# EAGLE design V3_nano (EAGLE 8.5.1)

## Sheet 1 of 8: ATMEGA328p
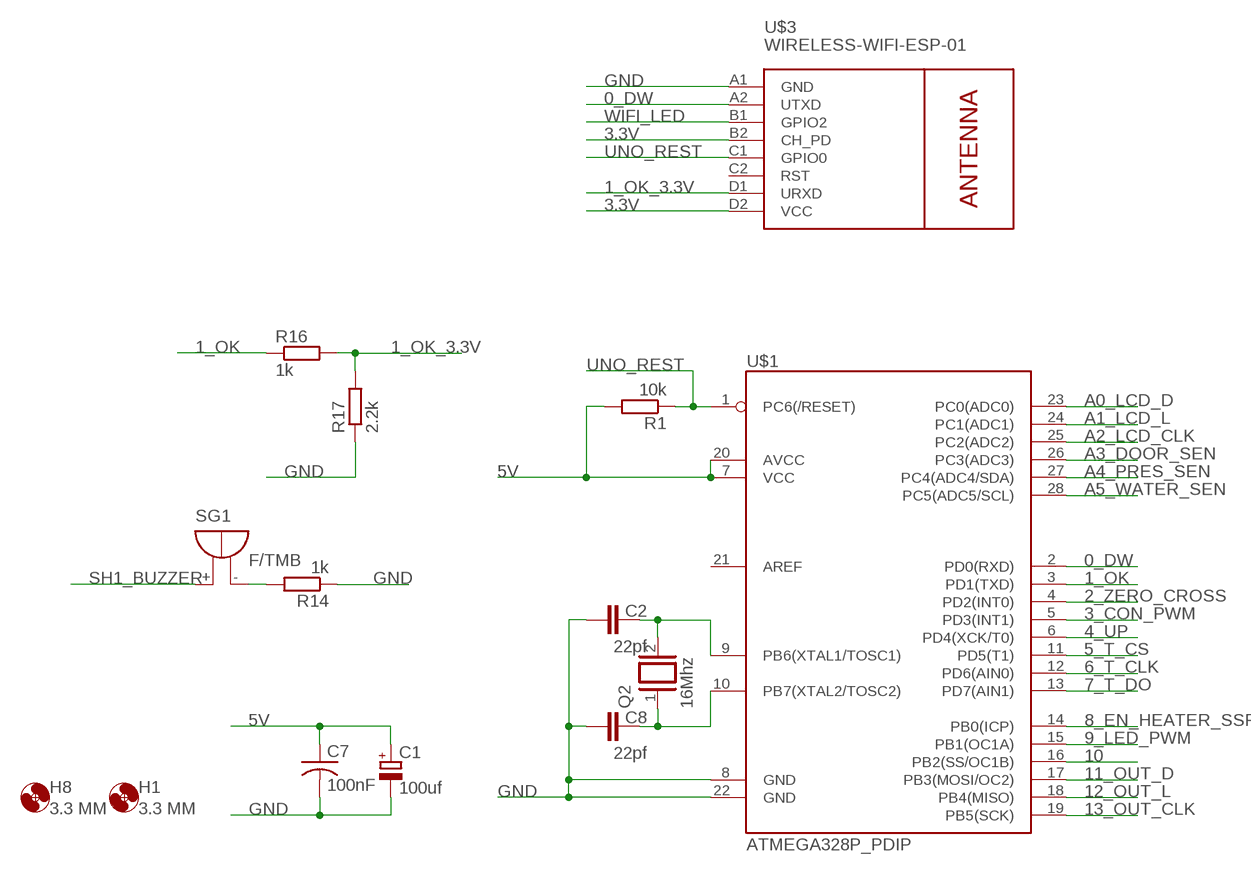
[diagram p0: schematic, sheet 1]

### Parts
C1  100uf  CPOL-EUE3.5-8  [E3,5-8]
C2  22pf  C-EU050-030X075  [C050-030X075]
C7  100nF  C-US050-035X075  [C050-035X075]
C8  22pf  C-EU050-030X075  [C050-030X075]
H1  3.3 MM  MOUNT-HOLE3.3  [3,3]
H8  3.3 MM  MOUNT-HOLE3.3  [3,3]
Q2  16Mhz  XTAL/S  [QS]
R1  10k  R-EU_0207/10  [0207/10]
R14  1k  R-EU_0207/10  [0207/10]
R16  1k  R-EU_0207/10  [0207/10]
R17  2.2k  R-EU_0207/10  [0207/10]
SG1  F/TMB  [F/TMB]
U$1  ATMEGA328P_PDIP  [DIL-28-3]
U$3  WIRELESS-WIFI-ESP-01  [WIRELESS-WIFI-ESP-01]

### Nets
0_DW: U$1.2(PD0(RXD)) U$3.A2(UTXD) ; also sheet 5
1_OK: R16.1 U$1.3(PD1(TXD)) ; also sheet 5
1_OK_3.3V: R16.2 R17.2 U$3.D1(URXD)
2_ZERO_CROSS: U$1.4(PD2(INT0)) ; also sheet 4
3.3V: U$3.B2(CH_PD) U$3.D2(VCC) ; also sheet 6
3_CON_PWM: U$1.5(PD3(INT1)) ; also sheet 3
4_UP: U$1.6(PD4(XCK/T0)) ; also sheet 5
5_T_CS: U$1.11(PD5(T1))
5V: C1.+ C7.1 R1.2 U$1.7(VCC) U$1.20(AVCC) ; also sheet 3,4,5,6,7,8
6_T_CLK: U$1.12(PD6(AIN0))
7_T_DO: U$1.13(PD7(AIN1))
8_EN_HEATER_SSR: U$1.14(PB0(ICP)) ; also sheet 5
9_LED_PWM: U$1.15(PB1(OC1A)) ; also sheet 3
10: U$1.16(PB2(SS/OC1B))
11_OUT_D: U$1.17(PB3(MOSI/OC2)) ; also sheet 8
12_OUT_L: U$1.18(PB4(MISO)) ; also sheet 8
13_OUT_CLK: U$1.19(PB5(SCK)) ; also sheet 8
A0_LCD_D: U$1.23(PC0(ADC0)) ; also sheet 3
A1_LCD_L: U$1.24(PC1(ADC1)) ; also sheet 3
A2_LCD_CLK: U$1.25(PC2(ADC2)) ; also sheet 3
A3_DOOR_SEN: U$1.26(PC3(ADC3)) ; also sheet 5
A4_PRES_SEN: U$1.27(PC4(ADC4/SDA)) ; also sheet 5
A5_WATER_SEN: U$1.28(PC5(ADC5/SCL)) ; also sheet 5
GND: C1.- C2.1 C7.2 C8.1 R14.1 R17.1 U$1.8(GND) U$1.22(GND) U$3.A1(GND) ; also sheet 3,4,5,6,7,8
N$1: C2.2 Q2.2 U$1.9(PB6(XTAL1/TOSC1))
N$4: C8.2 Q2.1 U$1.10(PB7(XTAL2/TOSC2))
N$62: R14.2 SG1.-
SH1_BUZZER: SG1.+ ; also sheet 8
UNO_REST: R1.1 U$1.1(PC6(/RESET)) U$3.C1(GPIO0)
WIFI_LED: U$3.B1(GPIO2)
Unconnected: U$1.21(AREF) U$3.C2(RST)

## Sheet 2 of 8: Relays
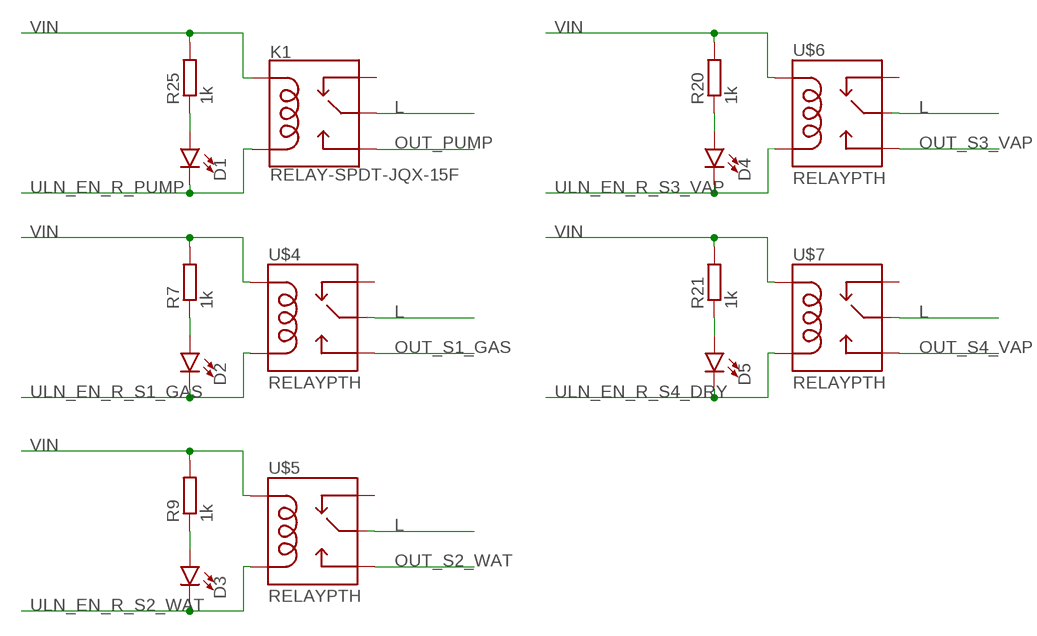
[diagram p1: schematic, sheet 2]

### Parts
D1  LED5MM  [LED_5MM]
D2  LED5MM  [LED_5MM]
D3  LED5MM  [LED_5MM]
D4  LED5MM  [LED_5MM]
D5  LED5MM  [LED_5MM]
K1  RELAY-SPDT-JQX-15F  [RELAY-T90]
R7  1k  R-EU_0207/10  [0207/10]
R9  1k  R-EU_0207/10  [0207/10]
R20  1k  R-EU_0207/10  [0207/10]
R21  1k  R-EU_0207/10  [0207/10]
R25  1k  R-EU_0207/10  [0207/10]
U$4  RELAYPTH  [SRD-05VDC-SL-C]
U$5  RELAYPTH  [SRD-05VDC-SL-C]
U$6  RELAYPTH  [SRD-05VDC-SL-C]
U$7  RELAYPTH  [SRD-05VDC-SL-C]

### Nets
L: K1.MAIN U$4.SWCOMMON U$5.SWCOMMON U$6.SWCOMMON U$7.SWCOMMON ; also sheet 5
N$8: D2.A R7.1
N$10: D3.A R9.1
N$11: D4.A R20.1
N$13: D5.A R21.1
N$16: D1.A R25.1
OUT_PUMP: K1.NO ; also sheet 5
OUT_S1_GAS: U$4.SWOPEN ; also sheet 5
OUT_S2_WAT: U$5.SWOPEN ; also sheet 5
OUT_S3_VAP: U$6.SWOPEN ; also sheet 5
OUT_S4_VAP: U$7.SWOPEN
ULN_EN_R_PUMP: D1.K(C) K1.COIL2 ; also sheet 8
ULN_EN_R_S1_GAS: D2.K(C) U$4.COIL0 ; also sheet 8
ULN_EN_R_S2_WAT: D3.K(C) U$5.COIL0 ; also sheet 8
ULN_EN_R_S3_VAP: D4.K(C) U$6.COIL0 ; also sheet 8
ULN_EN_R_S4_DRY: D5.K(C) U$7.COIL0 ; also sheet 8
VIN: K1.COIL1 R7.2 R9.2 R20.2 R21.2 R25.2 U$4.COIL1 U$5.COIL1 U$6.COIL1 U$7.COIL1 ; also sheet 6,8
Unconnected: K1.NC U$4.SWCLOSED(SWCLOSE) U$5.SWCLOSED(SWCLOSE) U$6.SWCLOSED(SWCLOSE) U$7.SWCLOSED(SWCLOSE)

## Sheet 3 of 8: LCD_Shift
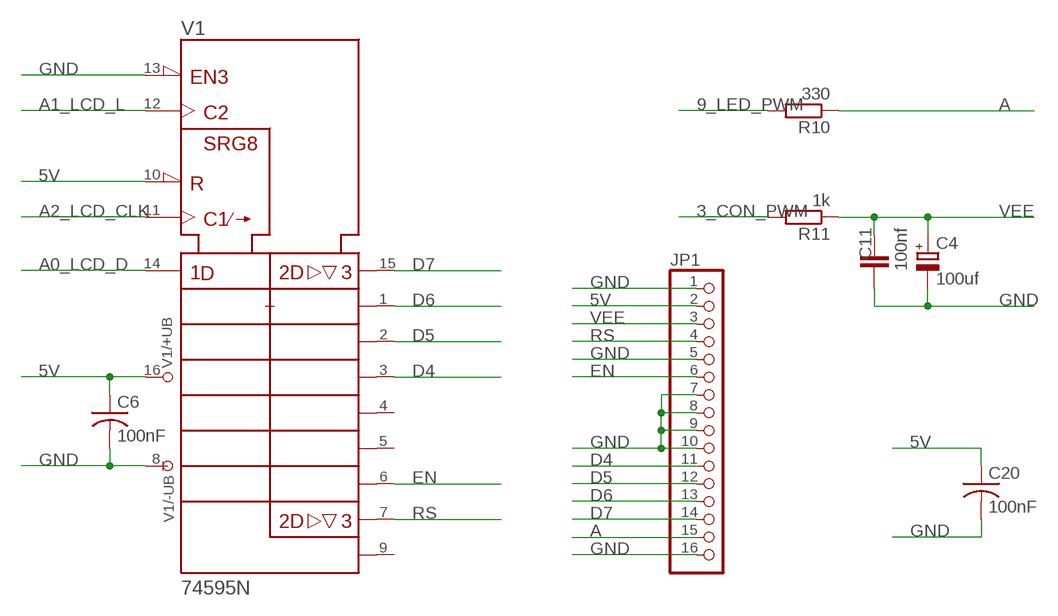
[diagram p2: schematic, sheet 3]

### Parts
C4  100uf  CPOL-EUE3.5-8  [E3,5-8]
C6  100nF  C-US050-035X075  [C050-035X075]
C11  100nf  C-EU050-030X075  [C050-030X075]
C20  100nF  C-US050-035X075  [C050-035X075]
JP1  PINHD-1X16  [1X16]
R10  330  R-EU_0207/10  [0207/10]
R11  1k  R-EU_0207/10  [0207/10]
V1  74595N  [DIL16]

### Nets
3_CON_PWM: R11.2 ; also sheet 1
5V: C6.1 C20.1 JP1.2 V1.10(!SRCLR) V1.16(+UB) ; also sheet 1,4,5,6,7,8
9_LED_PWM: R10.2 ; also sheet 1
A: JP1.15 R10.1
A0_LCD_D: V1.14(SER) ; also sheet 1
A1_LCD_L: V1.12(RCK) ; also sheet 1
A2_LCD_CLK: V1.11(SRCK) ; also sheet 1
D4: JP1.11 V1.3(QD)
D5: JP1.12 V1.2(QC)
D6: JP1.13 V1.1(QB)
D7: JP1.14 V1.15(QA)
EN: JP1.6 V1.6(QG)
GND: C4.- C6.2 C11.1 C20.2 JP1.1 JP1.5 JP1.7 JP1.8 JP1.9 JP1.10 JP1.16 V1.8(-UB) V1.13(!G) ; also sheet 1,4,5,6,7,8
RS: JP1.4 V1.7(QH)
VEE: C4.+ C11.2 JP1.3 R11.1
Unconnected: V1.4(QE) V1.5(QF) V1.9(QH*)

## Sheet 4 of 8: Zero_Cross Detect
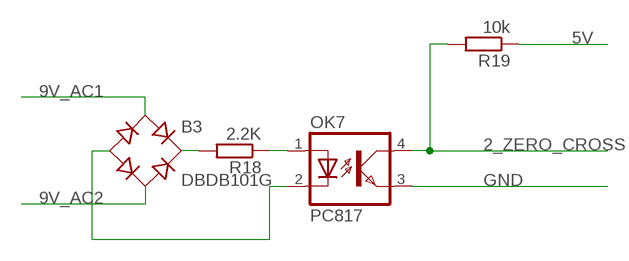
[diagram p3: schematic, sheet 4]

### Parts
B3  DBDB101G  [DB]
OK7  PC817  [DIL04]
R18  2.2K  R-EU_0207/10  [0207/10]
R19  10k  R-EU_0207/10  [0207/10]

### Nets
2_ZERO_CROSS: OK7.4(COL) R19.2 ; also sheet 1
5V: R19.1 ; also sheet 1,3,5,6,7,8
9V_AC1: B3.AC1 ; also sheet 5,6
9V_AC2: B3.AC2 ; also sheet 5,6
GND: OK7.3(EMIT) ; also sheet 1,3,5,6,7,8
N$47: B3.+ R18.2
N$48: OK7.1(A) R18.1
N$49: B3.- OK7.2(C)

## Sheet 5 of 8: Terminals
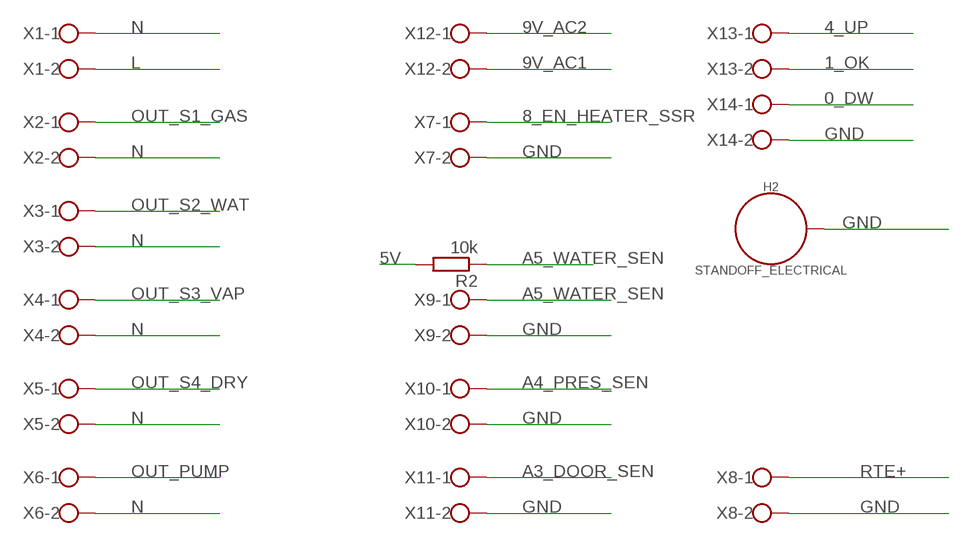
[diagram p4: schematic, sheet 5]

### Parts
H2  STANDOFF_ELECTRICAL  [STANDOFF-ELECTRICAL]
R2  10k  R-EU_0207/10  [0207/10]
X1  W237-102  [W237-102]
X2  W237-102  [W237-102]
X3  W237-102  [W237-102]
X4  W237-102  [W237-102]
X5  W237-102  [W237-102]
X6  W237-102  [W237-102]
X7  W237-102  [W237-102]
X8  W237-102  [W237-102]
X9  W237-102  [W237-102]
X10  W237-102  [W237-102]
X11  W237-102  [W237-102]
X12  W237-102  [W237-102]
X13  W237-102  [W237-102]
X14  W237-102  [W237-102]

### Nets
0_DW: X14.1 ; also sheet 1
1_OK: X13.2 ; also sheet 1
4_UP: X13.1 ; also sheet 1
5V: R2.2 ; also sheet 1,3,4,6,7,8
8_EN_HEATER_SSR: X7.1 ; also sheet 1
9V_AC1: X12.2 ; also sheet 4,6
9V_AC2: X12.1 ; also sheet 4,6
A3_DOOR_SEN: X11.1 ; also sheet 1
A4_PRES_SEN: X10.1 ; also sheet 1
A5_WATER_SEN: R2.1 X9.1 ; also sheet 1
GND: H2.P1 X7.2 X8.2 X9.2 X10.2 X11.2 X14.2 ; also sheet 1,3,4,6,7,8
L: X1.2 ; also sheet 2
N: X1.1 X2.2 X3.2 X4.2 X5.2 X6.2
OUT_PUMP: X6.1 ; also sheet 2
OUT_S1_GAS: X2.1 ; also sheet 2
OUT_S2_WAT: X3.1 ; also sheet 2
OUT_S3_VAP: X4.1 ; also sheet 2
OUT_S4_DRY: X5.1
RTE+: X8.1 ; also sheet 7

## Sheet 6 of 8: POWER
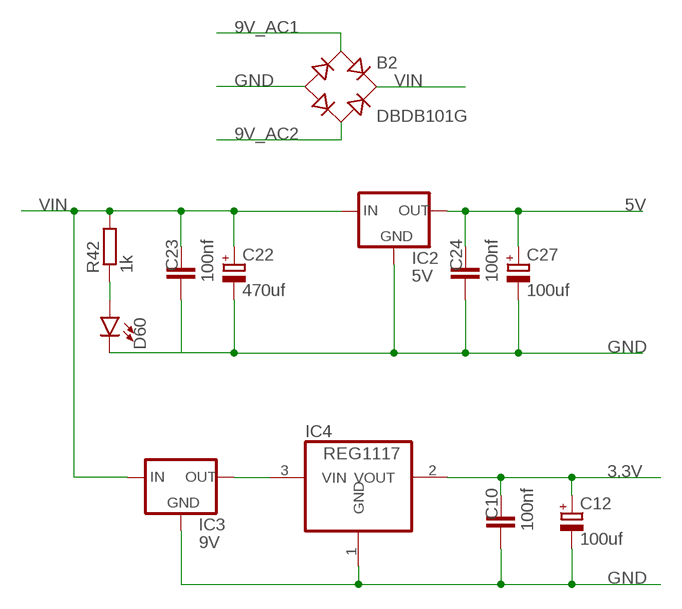
[diagram p5: schematic, sheet 6]

### Parts
B2  DBDB101G  [DB]
C10  100nf  C-EU050-030X075  [C050-030X075]
C12  100uf  CPOL-EUE3.5-8  [E3,5-8]
C22  470uf  CPOL-EUE3.5-8  [E3,5-8]
C23  100nf  C-EU050-030X075  [C050-030X075]
C24  100nf  C-EU050-030X075  [C050-030X075]
C27  100uf  CPOL-EUE3.5-8  [E3,5-8]
D60  LED5MM  [LED_5MM]
IC2  5V  V_REG_78XXSIDE  [78XXL]
IC3  9V  V_REG_78XXSIDE  [78XXL]
IC4  REG1117  [SOT223]
R42  1k  R-EU_0207/10  [0207/10]

### Nets
3.3V: C10.2 C12.+ IC4.2(VOUT) ; also sheet 1
5V: C24.2 C27.+ IC2.OUT ; also sheet 1,3,4,5,7,8
9V_AC1: B2.AC1 ; also sheet 4,5
9V_AC2: B2.AC2 ; also sheet 4,5
GND: B2.- C10.1 C12.- C22.- C23.1 C24.1 C27.- D60.K(C) IC2.GND IC3.GND IC4.1(GND) ; also sheet 1,3,4,5,7,8
N$12: IC3.OUT IC4.3(VIN)
N$74: D60.A R42.1
VIN: B2.+ C22.+ C23.2 IC2.IN IC3.IN R42.2 ; also sheet 2,8

## Sheet 7 of 8: Thermocoupler
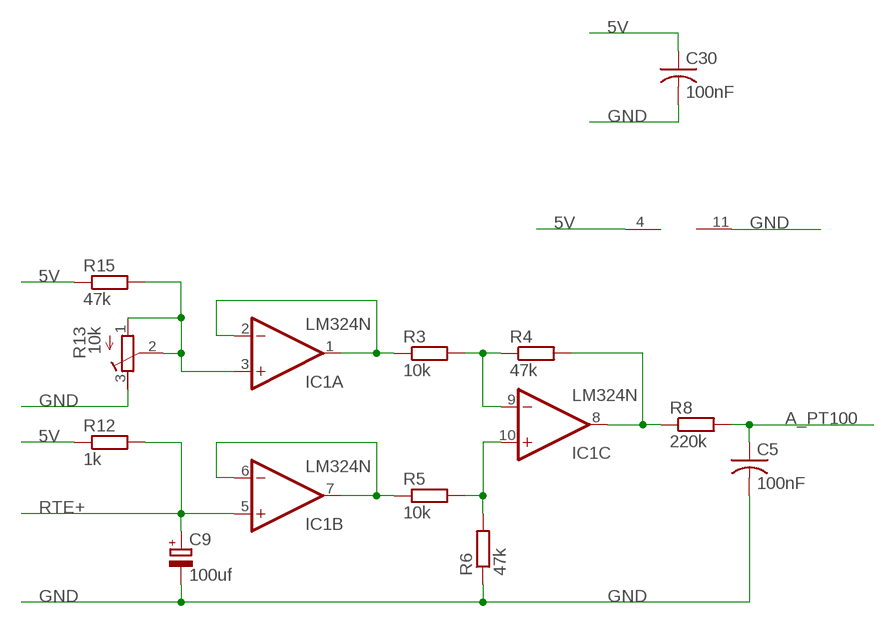
[diagram p6: schematic, sheet 7]

### Parts
C5  100nF  C-US050-035X075  [C050-035X075]
C9  100uf  CPOL-EUE3.5-8  [E3,5-8]
C30  100nF  C-US050-035X075  [C050-035X075]
IC1  LM324N  [DIL14]
R3  10k  R-EU_0207/10  [0207/10]
R4  47k  R-EU_0207/10  [0207/10]
R5  10k  R-EU_0207/10  [0207/10]
R6  47k  R-EU_0207/10  [0207/10]
R8  220k  R-EU_0207/10  [0207/10]
R12  1k  R-EU_0207/10  [0207/10]
R13  10k  R-TRIMM64W  [RTRIM64W]
R15  47k  R-EU_0207/10  [0207/10]

### Nets
5V: C30.1 IC1.4(P:V+) R12.1 R15.1 ; also sheet 1,3,4,5,6,8
A_PT100: C5.1 R8.2
GND: C5.2 C9.- C30.2 IC1.11(P:V-) R6.1 R13.3(E) ; also sheet 1,3,4,5,6,8
N$2: IC1.1(A:OUT) IC1.2(A:-IN) R3.1
N$3: IC1.9(C:-IN) R3.2 R4.1
N$5: IC1.10(C:+IN) R5.2 R6.2
N$6: IC1.6(B:-IN) IC1.7(B:OUT) R5.1
N$7: IC1.8(C:OUT) R4.2 R8.1
N$22: IC1.3(A:+IN) R13.1(A) R13.2(S) R15.2
RTE+: C9.+ IC1.5(B:+IN) R12.2 ; also sheet 5
Unconnected: IC1.12(D:+IN) IC1.13(D:-IN) IC1.14(D:OUT)

## Sheet 8 of 8: Shift Outputs
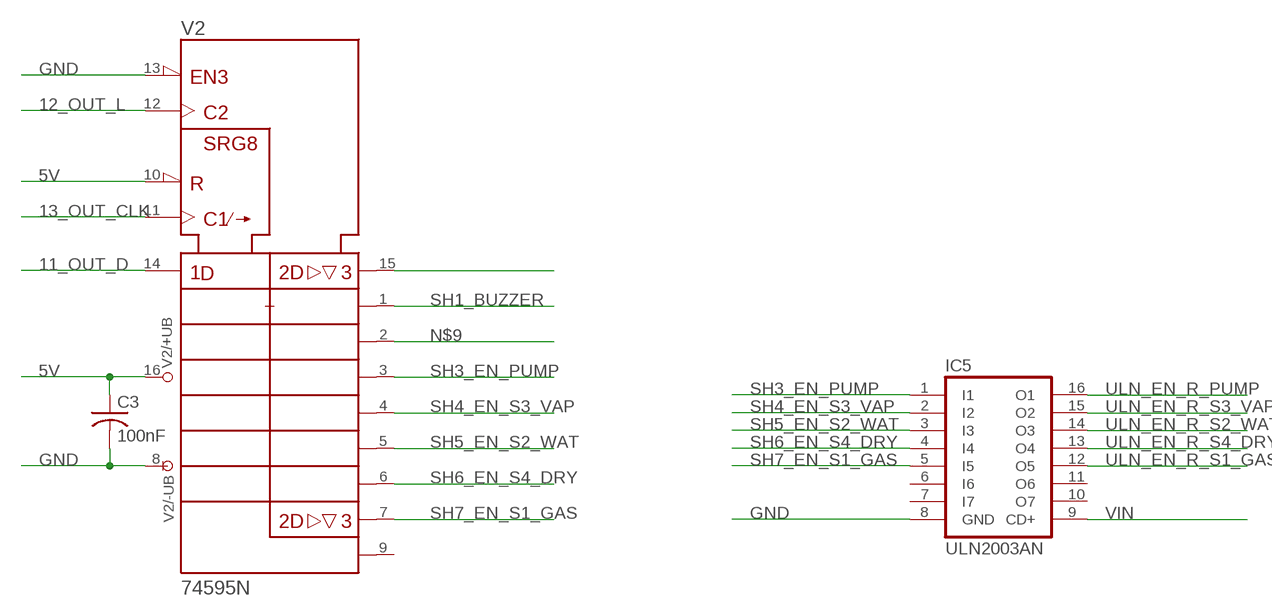
[diagram p7: schematic, sheet 8]

### Parts
C3  100nF  C-US050-035X075  [C050-035X075]
IC5  ULN2003AN  [DIL16]
V2  74595N  [DIL16]

### Nets
5V: C3.1 V2.10(!SRCLR) V2.16(+UB) ; also sheet 1,3,4,5,6,7
11_OUT_D: V2.14(SER) ; also sheet 1
12_OUT_L: V2.12(RCK) ; also sheet 1
13_OUT_CLK: V2.11(SRCK) ; also sheet 1
GND: C3.2 IC5.8(GND) V2.8(-UB) V2.13(!G) ; also sheet 1,3,4,5,6,7
N$9: V2.2(QC)
N$14: V2.15(QA)
SH1_BUZZER: V2.1(QB) ; also sheet 1
SH3_EN_PUMP: IC5.1(I1) V2.3(QD)
SH4_EN_S3_VAP: IC5.2(I2) V2.4(QE)
SH5_EN_S2_WAT: IC5.3(I3) V2.5(QF)
SH6_EN_S4_DRY: IC5.4(I4) V2.6(QG)
SH7_EN_S1_GAS: IC5.5(I5) V2.7(QH)
ULN_EN_R_PUMP: IC5.16(O1) ; also sheet 2
ULN_EN_R_S1_GAS: IC5.12(O5) ; also sheet 2
ULN_EN_R_S2_WAT: IC5.14(O3) ; also sheet 2
ULN_EN_R_S3_VAP: IC5.15(O2) ; also sheet 2
ULN_EN_R_S4_DRY: IC5.13(O4) ; also sheet 2
VIN: IC5.9(CD+) ; also sheet 2,6
Unconnected: IC5.6(I6) IC5.7(I7) IC5.10(O7) IC5.11(O6) V2.9(QH*)

## Library data of the parts
B2 B3 = rectifier:DB?*G: Single Phase 1.0 AMP Glass Passivated Bridge Rectifier Taiwan Semiconductor Co.,Ltd. - TSC Source: http://www.taiwansemi.com/TSCbig5/ezcatfiles/cust/img/img/db101g.pdf http://www.ts.com.tw/db/pictures/modules/PDT/PDT060207001/DBLS201G.pdf
C1 C4 C9 C12 C22 C27 = rcl:CPOL-EU: POLARIZED CAPACITOR, European symbol
C2 C8 C10 C11 C23 C24 = rcl:C-EU: CAPACITOR, European symbol
C3 C5-C7 C20 C30 = rcl:C-US: CAPACITOR, American symbol; SPICEPREFIX: C
D1-D5 D60 = SparkFun-LED:LED: LED (Generic) Standard schematic elements and footprints for 5mm, 3mm, 1206, and 0603 sized LEDs. Generic LEDs with no color specified.
H1 H8 = holes:MOUNT-HOLE: MOUNTING HOLE with drill center marker
H2 = SparkFun-Hardware:STANDOFF_ELECTRICAL: Stand Off Drill holes with an electrical connection. For example, use these to ground your board to a chassis. Example SparkFun Products Screw - Phillips Head (1/4", 4-40, 10 pack) <https://www.sparkfun.com/products/10453> (PRT-10453) Screw - Phillips Head (1/2", 4-40, 10 pack) <https://www.sparkfun.com/products/10452> (PRT-10452) Screw - Phillips Head (3/4", 4-40, 10 pack) <https://www.sparkfun.com/products/10451> (PRT-10451) Screw - Phillips Head (1", 4-40, 10 pack) <https://www.sparkfun.com/products/10450> (PRT-10450)
IC1 = linear:LM324: OP AMP
IC2 IC3 = SparkFun:V_REG_78XX: Voltage Regulator Standard 7805 5V regulator. IGO (Input Ground Output). Spark Fun Electronics SKU : COM-00107
IC4 = burr-brown:REG1117: 800mA and 1A Low Dropout (LDO) Positive Regulator 1.8V, 2.5V, 2.85V, 3.3V, 5V, and Adj
IC5 = uln-udn:ULN2003A: DRIVER ARRAY
JP1 = pinhead:PINHD-1X16: PIN HEADER
K1 = SparkFun-Electromechanical:RELAY-SPDT: SPDT Electromechanical Relay Single-pole, double-throw sealed relays. When current is applied to the coil, it throws a simple changeover switch, terminating the connection from the NC contact to ground and closing the NO contact. Use them to switch high voltage/high current devices. SparkFun Products JQX-15F: Relay SPDT Sealed - 20A <https://www.sparkfun.com/products/10924> (COM-10924) JZC-11F: Relay SPDT Sealed <https://www.sparkfun.com/products/100> (COM-00100); PROD_ID: COMP-10736; SF_SKU: COM-10924
OK7 = optocoupler-2:PC817: SHARP OPTO COUPLER
Q2 = special:XTAL/S: CRYSTAL
R1-R12 R14-R21 R25 R42 = rcl:R-EU_: RESISTOR, European symbol
R13 = rcl:R-TRIMM: Trimm resistor; SPICEMODEL: X; SPICEPREFIXL: POT
SG1 = buzzer:F/TMB: BUZZER Source: Buerklin; OC_FARNELL: unknown; OC_NEWARK: unknown
U$1 = FaBo-MPU:ATMEGA328P_PDIP
U$3 = diy-modules:WIRELESS-WIFI-ESP-01: Wireless Wi-Fi ESP-01 Module based on ESP8266 chip Click here to find device on ebay.com <http://www.ebay.com/sch/esp8266+esp+01+transceiver>
U$4-U$7 = SRD-05VDC-SL-C:RELAY: SPDT relay (COM-00101)
V1 V2 = 74ttl-din:74*595: 8-bit SHIFT REGISTER, output latch
X1-X14 = con-wago-500:W237-102: WAGO SCREW CLAMP; MPN: 237-102; OC_FARNELL: unknown; OC_NEWARK: 70K9898

## Board
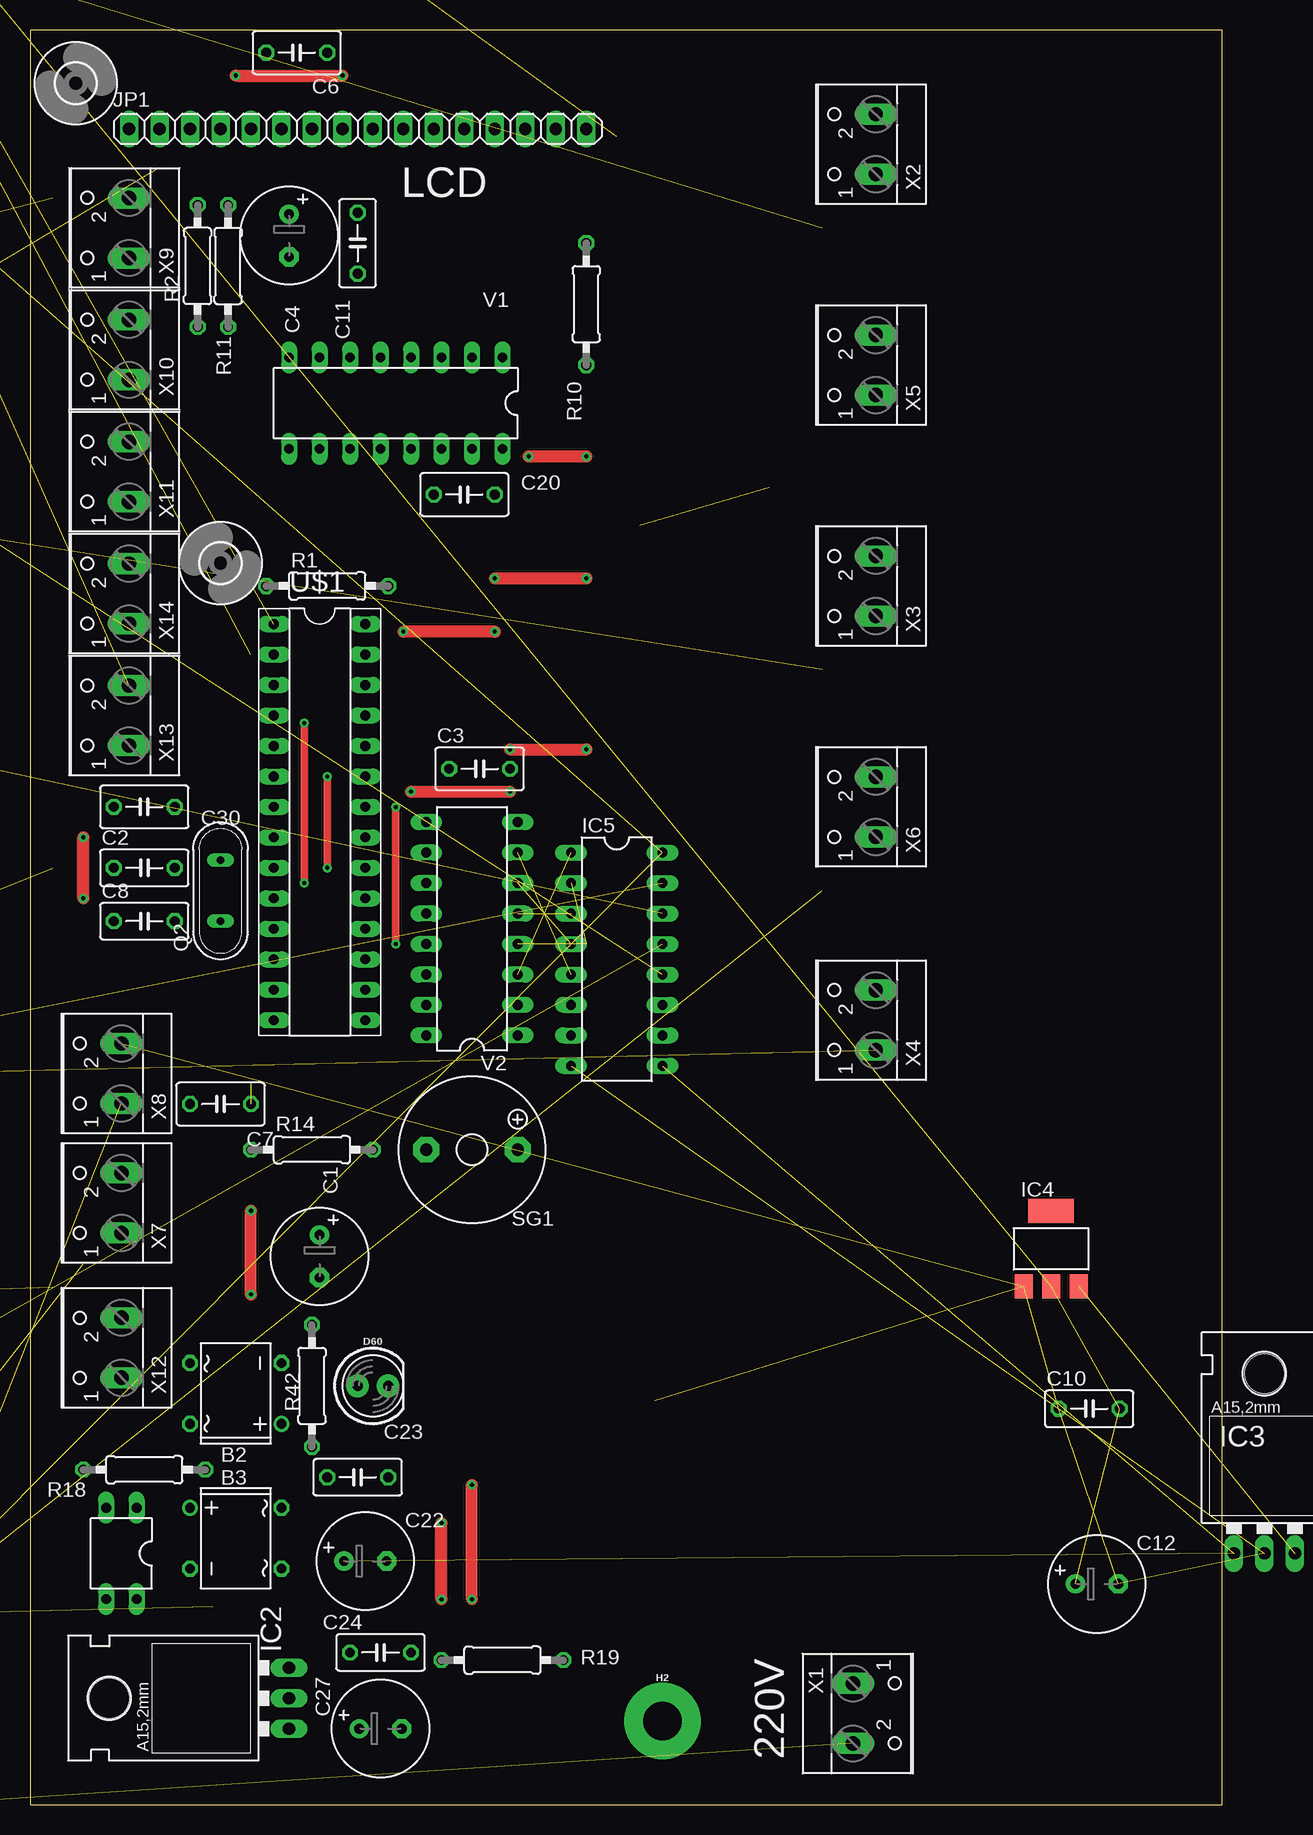
[diagram p8: board, top side]
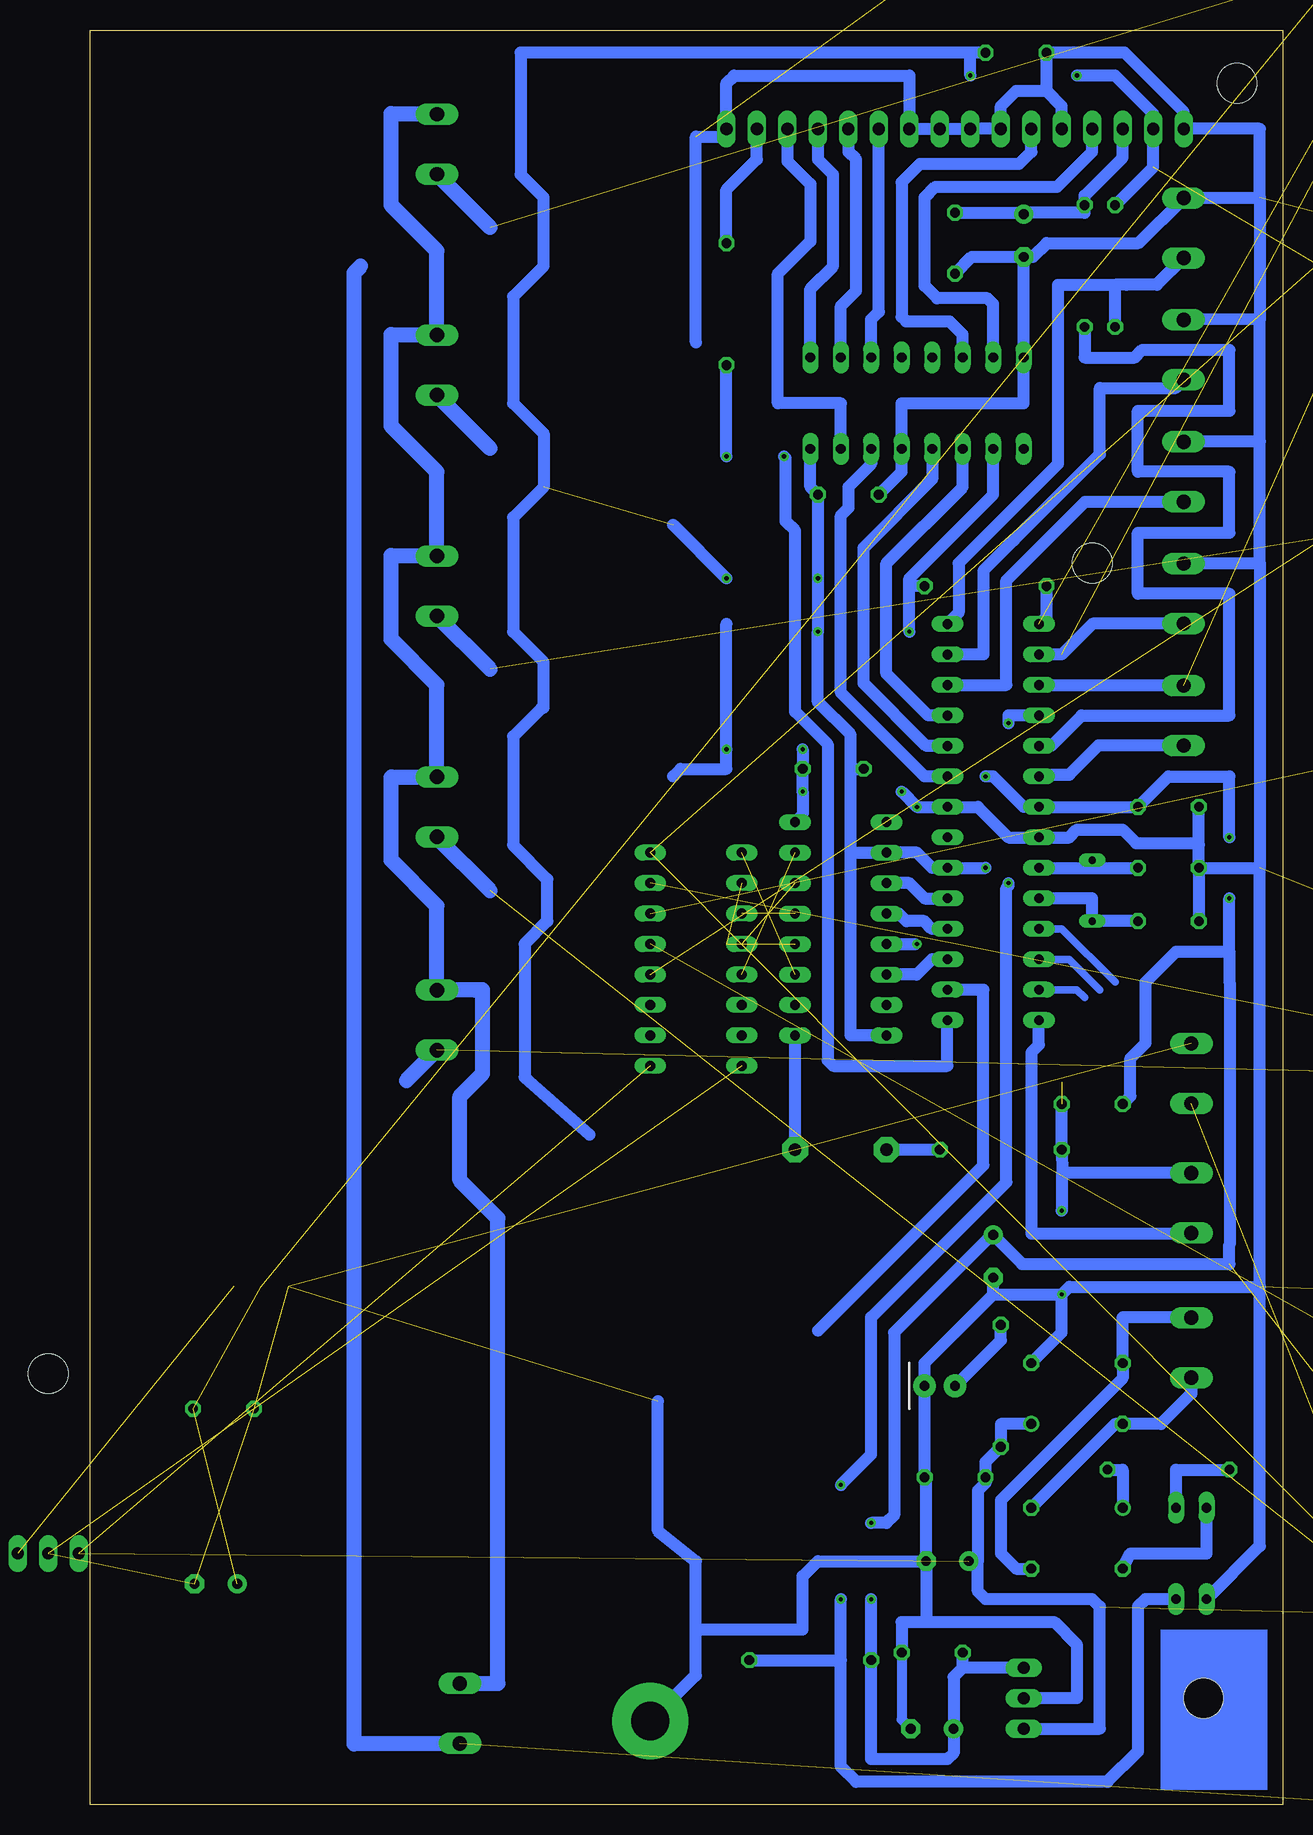
[diagram p9: board, bottom side, seen from below]

Size 99.36 x 147.94 mm. Coordinates in mm from the lower left corner, seen from the top.
Outline: 0,0 99.36,0 99.36,147.94 0,147.94 0,0
Copper layers (1*16): Top 0.035mm / dielectric 1.5mm / Bottom 0.035mm
Design rules "default *": minimum track width 6mil, minimum drill 0.35mm, track to track 35mil, track to pad 35mil, pad to pad 6mil, via to via 6mil, smd to smd 6mil, copper to edge 40mil, drill to drill 6mil, minimum pad ring 10mil, minimum via ring 8mil, stop-mask expansion 4mil, vias tented up to drill 0mil, thermal gap 10mil

### Footprints (pad centres in the part's own frame; a part is rotated, then mirrored left to right if it is on the bottom)
DB = drill 0.813: + -2.54,-3.81 | drill 0.813 octagon: - 2.54,-3.81; AC1 2.54,3.81; AC2 -2.54,3.81
E3,5-8 = drill 0.813 pad 1.6: + -1.778,0 | drill 0.813 pad 1.6 octagon: - 1.778,0
C050-030X075 = drill 0.813 octagon: 1 -2.54,0; 2 2.54,0
C050-035X075 = drill 0.813 octagon: 1 -2.54,0; 2 2.54,0
LED_5MM = drill 0.813 pad 1.88: A -1.27,0; K 1.27,0
3,3 = hole 3.3: 0,0
STANDOFF-ELECTRICAL = drill 3.2 pad 6.35: P1 0,0
DIL14 = drill 0.813 long: 1 -7.62,-3.81; 2 -5.08,-3.81; 3 -2.54,-3.81; 4 0,-3.81; 5 2.54,-3.81; 6 5.08,-3.81; 7 7.62,-3.81; 8 7.62,3.81; 9 5.08,3.81; 10 2.54,3.81; 11 0,3.81; 12 -2.54,3.81; 13 -5.08,3.81; 14 -7.62,3.81
78XXL = drill 1.016 long: GND 0,-3.81; IN -2.54,-3.81; OUT 2.54,-3.81 | hole 3.302: 0,11.176
SOT223 = smd 1.499 x 2.007: 1 -2.261,-3.15; 2 0.025,-3.15; 3 2.311,-3.15 | smd 3.81 x 2.007: 4 0,3.15
DIL16 = drill 0.813 long: 1 -8.89,-3.81; 2 -6.35,-3.81; 3 -3.81,-3.81; 4 -1.27,-3.81; 5 1.27,-3.81; 6 3.81,-3.81; 7 6.35,-3.81; 8 8.89,-3.81; 9 8.89,3.81; 10 6.35,3.81; 11 3.81,3.81; 12 1.27,3.81; 13 -1.27,3.81; 14 -3.81,3.81; 15 -6.35,3.81; 16 -8.89,3.81
1X16 = drill 1.016 long: 1 -19.05,0; 2 -16.51,0; 3 -13.97,0; 4 -11.43,0; 5 -8.89,0; 6 -6.35,0; 7 -3.81,0; 8 -1.27,0; 9 1.27,0; 10 3.81,0; 11 6.35,0; 12 8.89,0; 13 11.43,0; 14 13.97,0; 15 16.51,0; 16 19.05,0
RELAY-T90 = drill 1.1 pad 1.956: COIL1 0,-13.9; COIL2 0,-3.81 | drill 2.1: MAIN -12.7,-17.78; NC -22.86,0; NO -15.24,0
DIL04 = drill 0.813 long: 1 -1.27,-3.81; 2 1.27,-3.81; 3 1.27,3.81; 4 -1.27,3.81
QS = drill 0.61 long: 1 -2.54,0; 2 2.54,0
0207/10 = drill 0.813 octagon: 1 -5.08,0; 2 5.08,0
RTRIM64W = drill 0.61: 1 1.27,-2.54; 2 1.27,0; 3 1.27,2.54
F/TMB = drill 1.016 pad 2.159 octagon: + 3.81,0; - -3.81,0
DIL-28-3 = drill 0.813 long: 1 -15.24,-3.81; 2 -12.7,-3.81; 3 -10.16,-3.81; 4 -7.62,-3.81; 5 -5.08,-3.81; 6 -2.54,-3.81; 7 0,-3.81; 8 2.54,-3.81; 9 5.08,-3.81; 10 7.62,-3.81; 11 10.16,-3.81; 12 12.7,-3.81; 13 15.24,-3.81; 14 17.78,-3.81; 15 17.78,3.81; 16 15.24,3.81; 17 12.7,3.81; 18 10.16,3.81; 19 7.62,3.81; 20 5.08,3.81; 21 2.54,3.81; 22 0,3.81; 23 -2.54,3.81; 24 -5.08,3.81; 25 -7.62,3.81; 26 -10.16,3.81; 27 -12.7,3.81; 28 -15.24,3.81
WIRELESS-WIFI-ESP-01 = drill 1 square: A1 -8.89,3.81; D1 -8.89,-3.81 | drill 1: A2 -11.43,3.81; B1 -8.89,1.27; B2 -11.43,1.27; C1 -8.89,-1.27; C2 -11.43,-1.27; D2 -11.43,-3.81
SRD-05VDC-SL-C = drill 0.9: COIL0 -5.39,-6.12; COIL1 -5.39,5.88; SWCLOSED 6.61,-6.12; SWCOMMON -7.39,-0.12; SWOPEN 6.61,5.88
W237-102 = drill 1.194 long: 1 -2.5,-1.27; 2 2.5,-1.27

### Placement (x,y rotation side)
B2  17.14,34.29 90 top
B3  17.14,22.23 270 top
C1  24.13,45.72 270 top
C2  9.53,78.11 0 top
C3  37.47,86.36 0 top
C4  21.59,130.81 270 top
C5  -17.78,42.55 0 top  (outside the outline)
C6  22.23,146.05 180 top
C7  15.88,58.42 0 top
C8  9.53,73.66 0 top
C9  -17.14,27.94 0 top  (outside the outline)
C10  88.27,33.02 0 top
C11  27.3,130.18 90 top
C12  88.9,18.41 0 top
C20  36.2,109.22 180 top
C22  27.94,20.32 0 top
C23  27.3,27.3 180 top
C24  29.21,12.7 180 top
C27  29.21,6.35 0 top
C30  9.53,83.19 180 top
D1  -93.98,207.65 0 top  (outside the outline)
D2  -93.98,148.59 0 top  (outside the outline)
D3  -93.98,89.53 0 top  (outside the outline)
D4  -93.98,30.48 0 top  (outside the outline)
D5  -93.98,-28.57 0 top  (outside the outline)
D60  28.57,34.92 0 top
H1  15.88,103.5 90 top
H2  52.7,6.99 0 top
H8  3.81,143.51 0 top
IC1  -12.7,126.36 0 top  (outside the outline)
IC2  17.78,8.89 90 top
IC3  102.87,24.77 0 top
IC4  85.09,46.35 0 top
IC5  48.9,70.48 270 top
JP1  27.3,139.7 0 top
K1  -87,-57.15 0 top  (outside the outline)
OK7  7.62,20.95 180 top
Q2  15.88,76.2 90 top
R1  24.77,101.6 0 top
R2  13.97,128.27 90 top
R3  -15.24,109.22 0 top  (outside the outline)
R4  -15.24,95.89 0 top  (outside the outline)
R5  -15.24,82.55 0 top  (outside the outline)
R6  -15.24,69.22 0 top  (outside the outline)
R7  -92.71,132.08 0 top  (outside the outline)
R8  -15.24,55.88 0 top  (outside the outline)
R9  -92.71,73.03 0 top  (outside the outline)
R10  46.35,125.09 270 top
R11  16.51,128.27 270 top
R12  -15.24,13.34 0 top  (outside the outline)
R13  -34.29,15.24 0 top  (outside the outline)
R14  23.5,54.61 0 top
R15  -26.67,0 0 top  (outside the outline)
R16  -14.61,156.21 0 top  (outside the outline)
R17  -14.61,142.88 0 top  (outside the outline)
R18  9.53,27.94 0 top
R19  39.37,12.06 0 top
R20  -92.71,13.97 0 top  (outside the outline)
R21  -92.71,-45.09 0 top  (outside the outline)
R25  -92.71,191.13 0 top  (outside the outline)
R42  23.5,34.92 270 top
SG1  36.83,54.61 0 top
U$1  24.13,83.19 270 top
U$3  -24.77,194.94 0 top  (outside the outline)
U$4  -90.17,171.45 0 top  (outside the outline)
U$5  -90.17,112.39 0 top  (outside the outline)
U$6  -90.17,53.34 0 top  (outside the outline)
U$7  -90.17,-5.71 0 top  (outside the outline)
V1  30.48,116.84 180 top
V2  36.83,73.03 90 top
X1  69.85,7.62 270 top
X2  69.22,138.43 90 top
X3  69.22,101.6 90 top
X4  69.22,65.41 90 top
X5  69.22,120.02 90 top
X6  69.22,83.19 90 top
X7  6.35,50.16 90 top
X8  6.35,60.96 90 top
X9  6.99,131.44 90 top
X10  6.99,121.28 90 top
X11  6.99,111.12 90 top
X12  6.35,38.1 90 top
X13  6.99,90.81 90 top
X14  6.99,100.97 90 top

### Tracks (layer width: path | path; a pad name or v marks a point on that pad's centre or on a via)
0_DW  (1 unrouted)
  Bottom 1.016: X14.1 15.84,98.47 18.41,95.89 U$1.2
1_OK  (1 unrouted)
  Bottom 1.016: 8.26,93.34 X13.2 20.28,93.31 U$1.3
1_OK_3.3V  (2 unrouted)
2_ZERO_CROSS  (via drill 0.35)
  Top 0.61: v22.86,90.17 v22.86,76.83
  Top 1.016: v36.83,17.14 v36.83,26.67
  Bottom 1.016: OK7.4 11.43,17.14 12.06,16.51 12.06,4.45 14.61,1.91 35.56,1.91 36.83,3.17 36.83,12.06 | v36.83,26.67 34.29,29.21 34.29,40.64 23.04,51.89 23.04,76.42 22.86,76.59 v22.86,76.83 | 36.83,12.06 v36.83,17.14 | R19.2 36.83,12.06 | U$1.4 22.86,90.81 v22.86,90.17
3.3V  (4 unrouted)
3_CON_PWM
  Bottom 1.016: U$1.5 19.29,88.27 16.75,90.81 4.45,90.81 4.45,100.97 12.06,100.97 12.06,106.05 4.45,106.05 4.45,111.12 12.06,111.12 12.06,116.2 4.45,116.2 4.45,121.28 11.7,121.28 12.33,120.65 16.51,120.65 R11.2
4_UP
  Bottom 1.016: X13.1 15.35,88.31 17.78,85.88 20.17,85.88 U$1.6
5_T_CS
  Bottom 0.61: 13.97,68.58 18.41,73.03 U$1.11
5V  (via drill 0.35)  (4 unrouted)
  Top 0.61: v24.77,78.11 v24.77,85.72
  Top 1.016: v34.29,17.14 v34.29,23.5 | v4.45,75.56 v4.45,80.64 | v17.14,144.15 v26.04,144.15 | v38.73,97.79 v31.11,97.79 | v46.35,102.23 v38.73,102.23
  Bottom 0.61: 12.7,62.23 12.7,60.33 | 12.7,59.05 12.7,60.33 | 12.78,60.25 12.7,60.33
  Bottom 1.016: IC2.OUT 26.67,11.43 | 26.67,11.43 27.43,10.67 C27.+ 27.43,4.32 27.94,3.81 34.29,3.81 R19.1 v34.29,17.14 | 26.67,11.43 C24.2 | 57.78,55.88 63.18,60.64 63.18,71.75 61.28,73.66 61.28,77.15 64.14,80.01 64.14,89.05 61.75,91.44 61.59,91.44 61.59,95.25 64.14,97.79 64.14,107.31 61.59,109.86 61.59,114.3 64.14,116.84 64.14,125.73 61.59,128.27 61.59,133.99 63.5,135.89 63.5,146.05 50.8,146.05 26.04,146.05 | v26.04,144.15 26.04,146.05 | R2.2 10.79,136.53 JP1.2 10.79,140.97 13.96,144.15 v17.14,144.15 | v4.45,80.64 4.45,85.72 9.53,85.72 C30.1 U$1.7 21.59,83.19 24.13,85.72 v24.77,85.72 | V1.10 24.13,109.22 31.11,102.23 31.11,101.6 | V1.16 39.37,109.86 C20.1 v38.73,102.23 v38.73,97.79 38.73,91.92 36.02,89.2 36.02,86.36 | v31.11,97.79 31.11,101.6 | R1.2 31.11,101.6 | v24.77,78.11 U$1.20 29.21,78.11 30.48,79.38 V2.10 36.02,79.38 | 50.8,106.68 v46.35,102.23 | C7.1 12.7,59.05 12.7,62.23 11.43,63.5 11.43,68.58 8.89,71.12 4.45,71.12 | v34.29,23.5 33.02,23.5 32.38,24.13 32.38,39.37 24.26,47.5 C1.+ 21.72,45.09 4.45,45.09 4.45,46.7 4.43,46.72 4.43,68.57 4.45,68.58 4.45,71.12 | V2.16 36.02,64.14 36.02,79.38 | 36.02,79.38 36.02,86.36 | 36.02,86.36 C3.1 | 4.45,71.12 v4.45,75.56 | C6.1 26.04,146.05
6_T_CLK
  Bottom 0.61: 15.24,67.94 17.78,70.48 U$1.12
7_T_DO
  Bottom 0.61: U$1.13 17.14,67.94 16.51,67.31
8_EN_HEATER_SSR
  Bottom 1.016: X7.1 8.21,47.62 20.95,47.62 20.95,62.71 20.32,63.35 U$1.14
9_LED_PWM  (via drill 0.35)
  Top 1.016: v46.35,112.39 v41.56,112.39
  Bottom 1.016: v46.35,112.39 R10.2 | U$1.15 27.94,61.59 37.47,61.59 37.92,62.05 37.92,88.41 40.64,91.13 40.64,106.2 41.43,106.99 41.43,112.27 v41.56,112.39
9V_AC1
  Bottom 1.016: B3.AC1 22.23,19.68 23.5,20.95 23.5,25.4 13.34,35.56 B2.AC1 13.34,40.6 13.29,40.64 7.66,40.64 X12.2
9V_AC2
  Bottom 1.016: B3.AC2 13.97,31.75 B2.AC2 10.16,31.75 7.62,34.29 X12.1
10
  Bottom 1.016: U$1.16 24.94,67.94 24.94,53.32 38.73,39.52
11_OUT_D
  Bottom 1.016: U$1.17 29.23,70.48 30.5,69.22 V2.14
12_OUT_L
  Bottom 1.016: 29.21,73.03 U$1.18 29.23,73.03 29.87,73.66 31.36,73.66 31.99,74.3 V2.12
13_OUT_CLK
  Bottom 1.016: U$1.19 29.84,75.56 31.11,76.83 V2.11
A
  Bottom 1.016: JP1.15 43.81,137.16 46.35,134.62 R10.1
A0_LCD_D
  Bottom 1.016: V1.14 34.29,111.76 36.2,109.86 36.2,108.1 36.83,107.47 36.83,92.71 29.84,85.72 U$1.23
A1_LCD_L
  Bottom 1.016: V1.12 29.21,110.49 34.92,104.78 34.92,93.5 29.69,88.27 U$1.24
A2_LCD_CLK
  Bottom 1.016: V1.11 26.67,109.86 33.02,103.5 33.02,94.29 29.54,90.81 U$1.25
A3_DOOR_SEN
  Bottom 1.016: X11.1 16.47,108.62 23.04,102.06 23.04,93.34 U$1.26
A4_PRES_SEN
  Bottom 1.016: 8.29,118.75 X10.1 8.93,118.11 15.24,118.11 15.24,112.57 24.94,102.87 | 24.94,102.87 24.94,95.89 U$1.27 | 24.94,102.87 | 22.4,105.41 24.94,102.87
A5_WATER_SEN
  Bottom 1.016: 13.97,126.7 13.04,126.7 10.5,126.7 X9.1 | 13.97,126.7 18.71,126.7 18.71,111.79 27,103.5 27,99.36 U$1.28 | R2.1 13.97,126.7
A_PT100  (1 unrouted)
D4
  Bottom 1.016: V1.3 34.29,123.83 33.66,124.46 JP1.11
D5
  Bottom 1.016: JP1.12 36.2,137.79 35.56,137.16 35.56,126.21 36.83,124.94 V1.2
D6
  Bottom 1.016: JP1.13 38.73,137.16 37.47,135.89 37.47,128.27 39.37,126.36 V1.1
D7
  Bottom 1.016: JP1.14 41.27,137.01 39.37,135.1 39.37,130.33 42.06,127.64 42.06,116.84 36.83,116.84 V1.15
EN
  Bottom 1.016: V1.6 26.67,122.56 27.79,123.67 31.38,123.67 31.75,124.04 31.75,135.25 30.23,136.78 21.97,136.78 20.95,137.79 JP1.6
GND  (via drill 0.35)  (14 unrouted)
  Top 0.61: v30.48,71.75 v30.48,83.19
  Top 1.016: v31.75,84.45 v40.01,84.45 | v18.41,42.55 v18.41,49.53 | v40.01,87.99 v46.35,87.99
  Bottom 0.61: 30.66,71.75 v30.48,71.75
  Bottom 0.813: C24.1 31.75,7.11 C27.-
  Bottom 1.016: C24.1 31.75,15.24 29.84,15.24 | 29.84,15.24 19.05,15.24 17.14,13.34 17.14,8.89 IC2.GND | 48.9,14.61 40.01,14.61 40.01,19.05 38.73,20.32 C22.- | 48.9,14.61 48.9,20.32 52.07,22.86 52.07,33.66 | C2.1 C8.1 | 24.13,42.55 29.84,36.83 D60.K C23.1 29.72,27.18 C22.- | 24.13,42.55 v18.41,42.55 | B2.- 18.41,39.37 v18.41,42.55 | OK7.3 1.91,21.59 1.91,43.18 | 1.91,43.18 1.91,78.11 | X14.2 8.21,103.5 1.91,103.5 | 1.91,103.5 1.91,78.11 | 1.91,103.5 1.91,113.67 | 1.91,113.67 1.91,123.83 | X10.2 8.29,123.78 1.91,123.83 | X11.2 8.21,113.67 1.91,113.67 | 1.91,133.99 8.21,133.99 X9.2 12.03,130.18 19.68,130.18 20.83,129.03 C4.- | 1.91,133.99 1.91,123.83 | 1.91,133.99 1.91,139.7 JP1.1 8.26,141.13 13.18,146.05 C6.2 19.68,142.88 | C2.1 1.91,78.11 | C11.1 25.91,129.03 C4.- | C4.- V1.8 21.59,116.84 31.75,116.84 V1.13 31.75,111.12 C20.2 | 46.35,98.42 v46.35,87.99 46.35,86.36 50.16,86.36 50.8,85.72 | 48.9,121.92 48.9,139.06 46.35,139.06 JP1.16 46.35,143.51 45.72,144.15 31.11,144.15 JP1.10 JP1.9 JP1.8 JP1.7 23.5,141.6 22.23,142.88 19.68,142.88 | X7.2 18.38,52.66 | v18.41,49.53 18.38,49.57 18.38,52.66 | v18.41,42.55 17.78,43.18 1.91,43.18 | C22.- 29.72,15.37 29.84,15.24 | v31.75,84.45 v30.48,83.19 U$1.22 25.4,83.19 22.86,80.64 U$1.8 17.78,80.64 17.14,81.28 13.34,81.28 12.22,80.16 7.14,80.16 6.99,80.01 | V2.13 30.66,71.75 | V2.8 40.01,82.55 v40.01,84.45 C3.2 v40.01,87.99 | 18.38,52.66 R14.1 C7.2 | H2.P1 48.9,10.79 48.9,14.61 | 24.13,42.55 C1.- | JP1.5 18.41,141.6 19.68,142.88 | C2.1 6.99,80.01 | 6.99,80.01 C30.2
L  (5 unrouted)
  Bottom 1.27: 76.83,128.27 77.39,127.71 77.39,5.08 68.62,5.08 X1.2
N
  Bottom 1.27: X1.1 65.41,10.12 65.41,48.9 68.58,52.07 68.58,59.05 66.67,60.96 66.67,67.94 67.27,67.94 67.31,67.91 X4.2 70.48,74.93 74.3,78.74 74.3,85.64 74.25,85.69 X6.2 70.48,93.34 74.3,97.16 74.3,104.14 70.53,104.14 X3.2 70.48,111.12 74.3,114.94 74.3,122.56 70.53,122.56 X5.2 70.48,129.54 74.3,133.35 74.3,140.97 70.53,140.97 X2.2
N$1
  Bottom 1.016: U$1.9 15.88,78.11 | 15.88,78.11 Q2.2 | 15.88,78.11 C2.2
N$2  (2 unrouted)
N$3  (2 unrouted)
N$4
  Bottom 1.016: U$1.10 15.88,75.56 Q2.1 C8.2
N$5  (2 unrouted)
N$6  (2 unrouted)
N$7  (2 unrouted)
N$8  (1 unrouted)
N$10  (1 unrouted)
N$11  (1 unrouted)
N$12  (1 unrouted)
N$13  (1 unrouted)
N$16  (1 unrouted)
N$22  (3 unrouted)
N$47
  Bottom 1.016: B3.+ 13.34,27.94 R18.2
N$48
  Bottom 1.016: OK7.1 8.89,27.94 R18.1
N$49
  Bottom 1.016: B3.- 12.7,20.95 6.35,20.95 OK7.2
N$62
  Bottom 1.016: R14.2 SG1.-
N$74
  Bottom 1.016: D60.A 23.5,38.73 R42.1
OUT_PUMP  (1 unrouted)
  Bottom 1.27: 70.44,80.64 X6.1 70.48,80.64 66.04,76.2
OUT_S1_GAS  (1 unrouted)
  Bottom 1.27: 66.04,131.49 X2.1
OUT_S2_WAT  (1 unrouted)
  Bottom 1.27: 66.04,94.66 X3.1
OUT_S3_VAP  (1 unrouted)
  Bottom 1.27: X4.1 73.03,60.37
OUT_S4_DRY
  Bottom 1.27: 66.04,113.07 X5.1
RS
  Bottom 1.016: JP1.4 15.88,137.79 18.8,134.87 28.96,134.87 29.84,133.99 29.84,126.63 28.79,125.58 24.61,125.58 24.13,125.09 V1.7
RTE+  (3 unrouted)
SH1_BUZZER
  Bottom 1.016: SG1.+ V2.1
SH3_EN_PUMP  (1 unrouted)
SH4_EN_S3_VAP  (2 unrouted)
SH5_EN_S2_WAT  (1 unrouted)
SH6_EN_S4_DRY  (1 unrouted)
SH7_EN_S1_GAS  (1 unrouted)
ULN_EN_R_PUMP  (2 unrouted)
ULN_EN_R_S1_GAS  (2 unrouted)
ULN_EN_R_S2_WAT  (2 unrouted)
ULN_EN_R_S3_VAP  (2 unrouted)
ULN_EN_R_S4_DRY  (2 unrouted)
UNO_REST  (1 unrouted)
  Bottom 1.016: U$1.1 19.68,99.06 R1.1
VEE
  Bottom 1.016: JP1.3 13.34,137.31 16.51,134.14 R11.1 16.51,132.72 21.46,132.72 | 21.46,132.72 C4.+ | C11.2 21.46,132.72
VIN  (12 unrouted)
  Bottom 1.016: IC2.IN 15.24,6.35 15.24,16.51 15.88,17.14 24.77,17.14 25.4,17.78 25.4,20.32 | B2.+ 23.5,31.75 R42.2 24.77,28.57 C23.2 24.77,26.82 25.4,26.19 25.4,20.32 | C22.+ 25.4,20.32
(copper drawn outside any net)
  shapes: Bottom area x1

### Text on the board
tNames: LCD | 220V
tDocu: S_GAS | S_DRY | SWITCHS | S_WAT | S_VAP | PUMP | POWER | 9V AC | START lite / H/W : V2 / S/W : V2 / MADE IN EGYPT